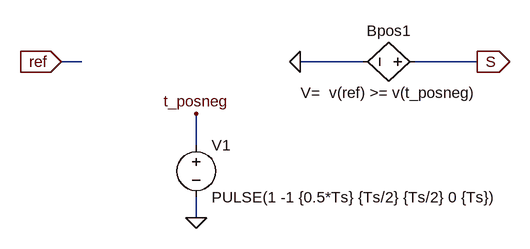
[diagram p0: schematic 2L_modulator.asc]
2L_modulator.asc, the LTspice schematic file:
Version 4
SHEET 1 880 680
WIRE -96 208 -128 208
WIRE 336 208 240 208
WIRE 512 208 416 208
WIRE 80 336 80 288
WIRE 80 448 80 416
FLAG 80 448 0
FLAG 80 288 t_posneg
FLAG 240 208 0
FLAG 512 208 S
IOPIN 512 208 Out
FLAG -128 208 ref
IOPIN -128 208 In
SYMBOL voltage 80 320 R0
WINDOW 123 0 0 Left 2
WINDOW 39 0 0 Left 2
SYMATTR InstName V1
SYMATTR Value PULSE(1 -1 {0.5*Ts} {Ts/2} {Ts/2} 0 {Ts})
SYMBOL bv 432 208 R90
WINDOW 0 -32 56 VBottom 2
WINDOW 3 32 56 VTop 2
SYMATTR InstName Bpos1
SYMATTR Value V=  v(ref) >= v(t_posneg)

The netlist it stands for:
* 2L_modulator.asc
V1 t_posneg 0 PULSE(1 -1 {0.5*Ts} {Ts/2} {Ts/2} 0 {Ts})
Bpos1 S 0 V=  v(ref) >= v(t_posneg)
.backanno
.end